# EasyEDA Pro project PCB.epro, board PCB1
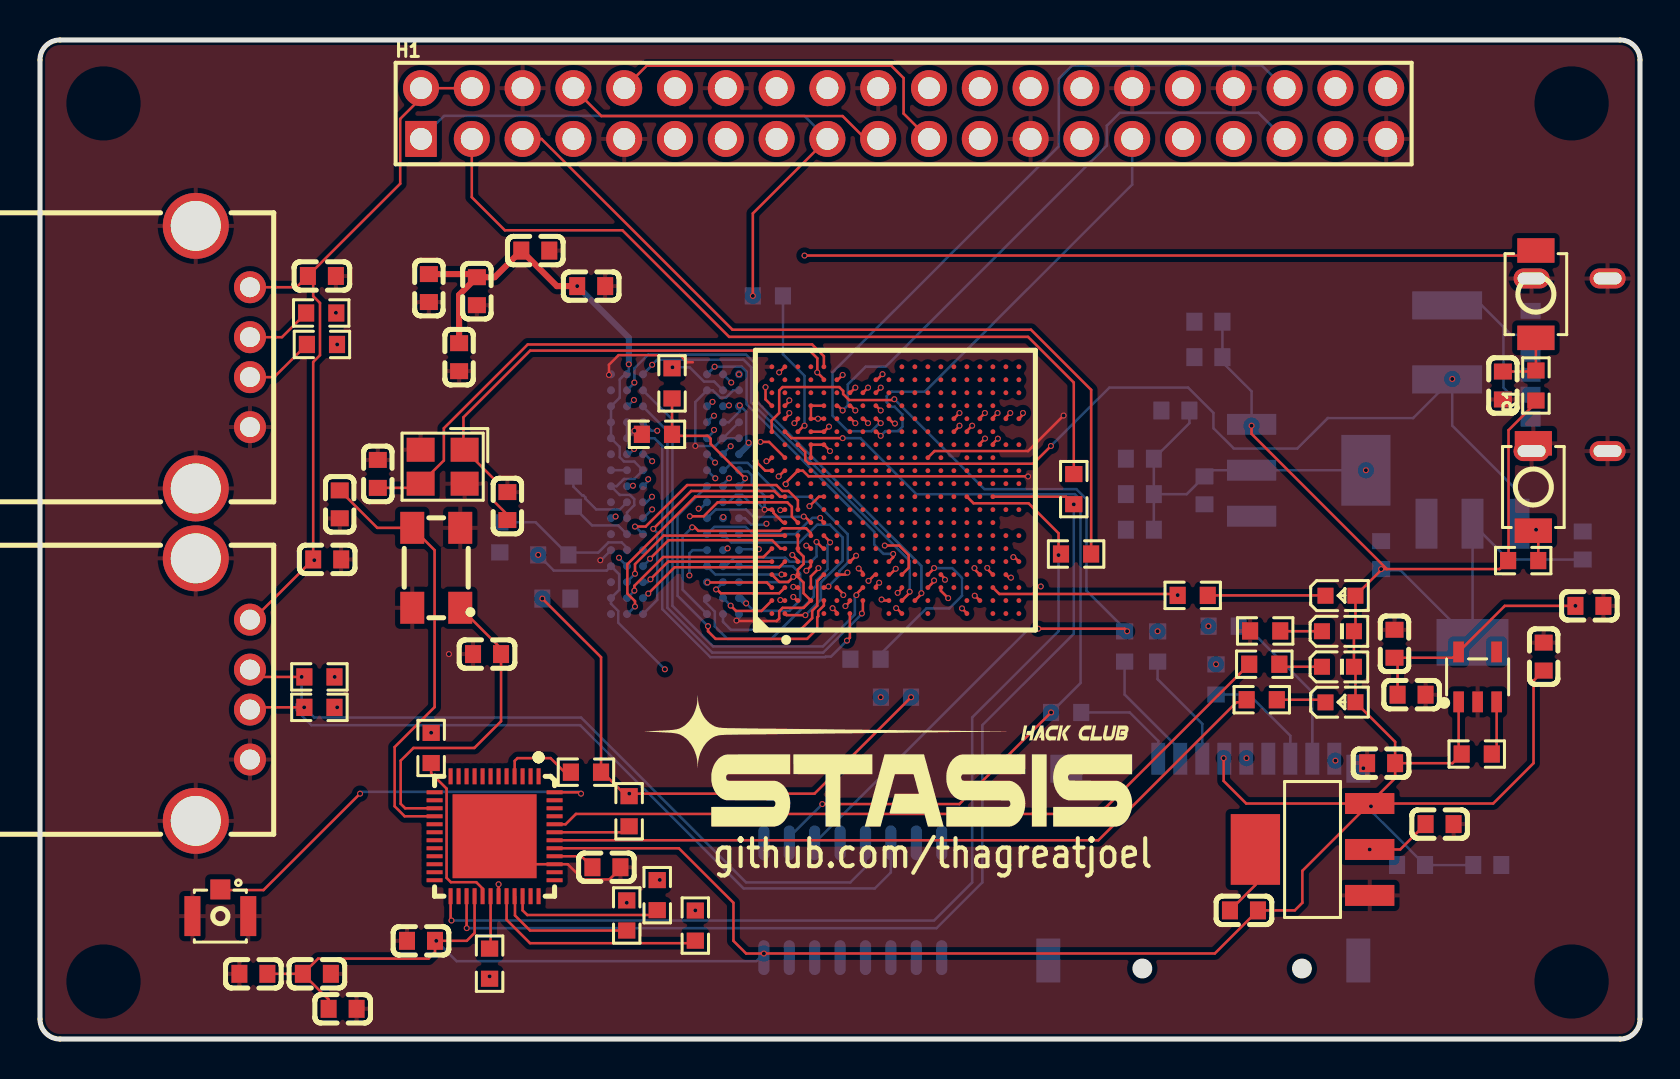
[diagram p1: board, top side]
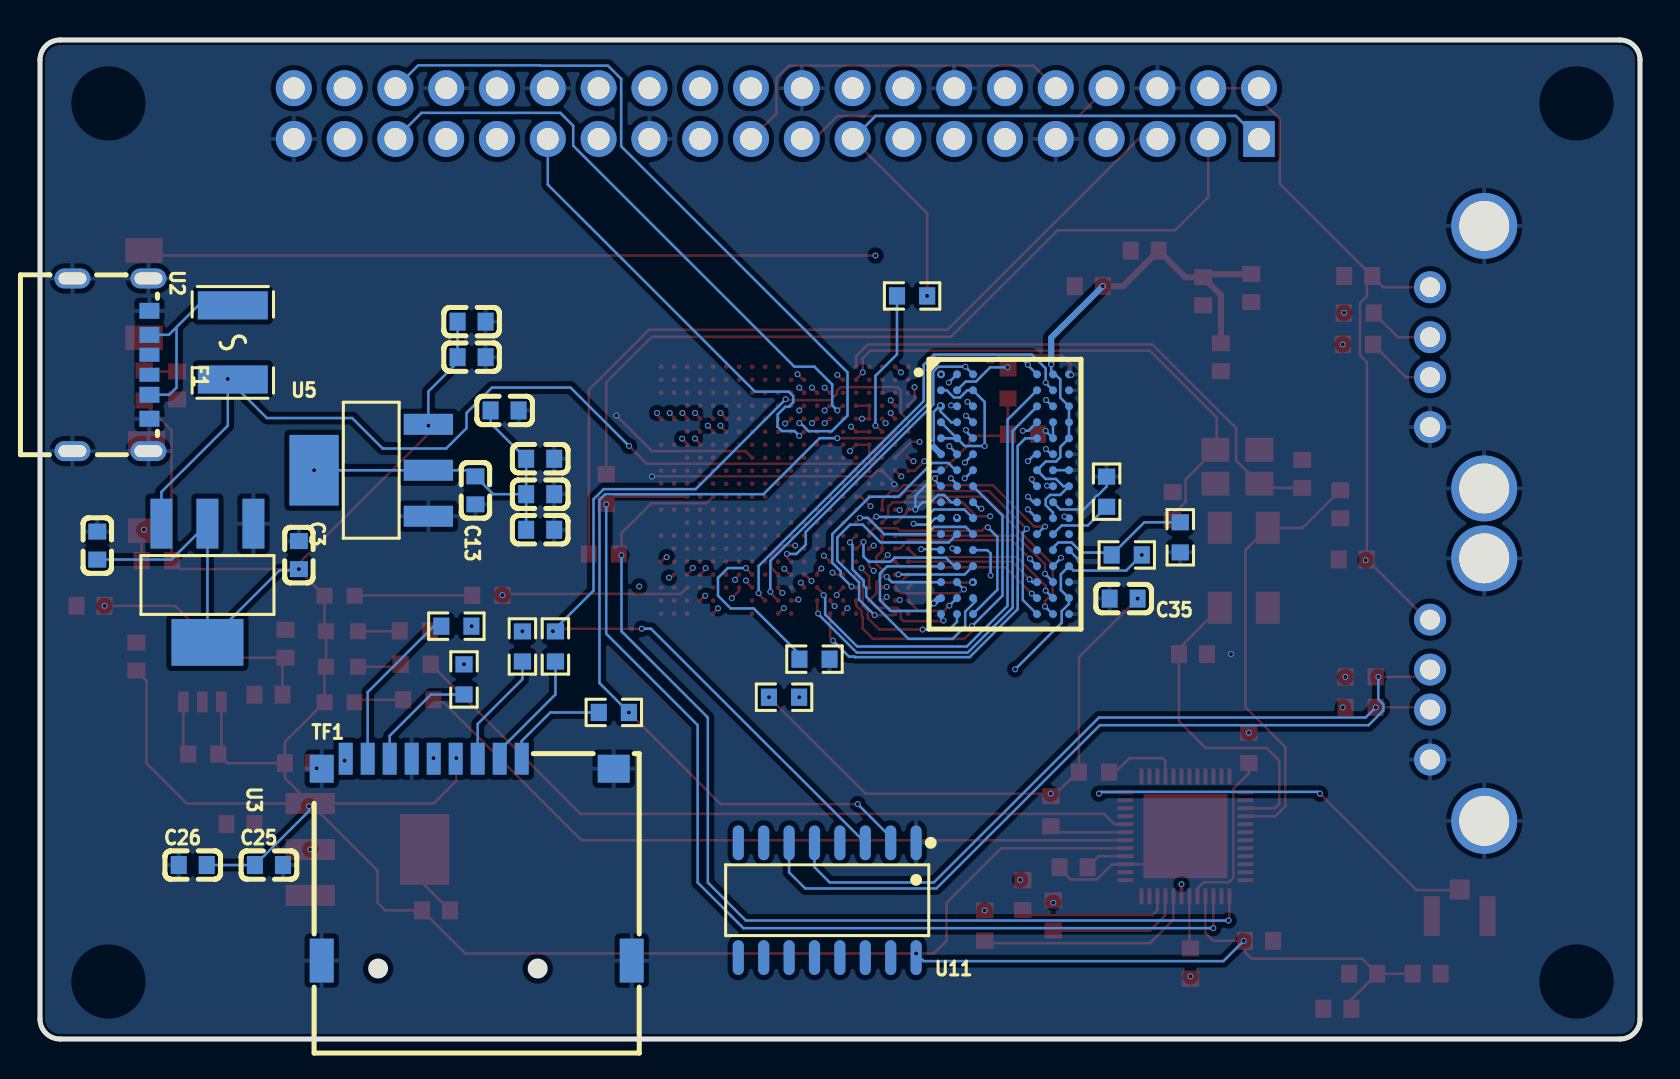
[diagram p2: board, bottom side, seen from below]

Outline 80 x 50 mm; copper layers: Top Layer, Inner1, Inner2, Inner3, Inner4, Bottom Layer. Coordinates in mm from the lower left corner of the outline.
Outline path: 0,49 0,1 arc(0.29,0.29) 1,0 79,0 arc(79.71,0.29) 80,1 80,49 arc(79.71,49.71) 79,50 1,50 arc(0.29,49.71) 0,49
Stack: Top Layer 0.035mm Outer layer thickness 1oz / Dielectric1 0.0994mm 3313 RC57% 4.2mil / Inner1 0.0152mm Inner layer thickness / Dielectric2 0.55mm 0.55mm H/H No copper / Inner2 0.0152mm Inner layer thickness / Dielectric3 0.1088mm 2116 RC54% 4.9mil / Inner3 0.0152mm Inner layer thickness / Dielectric4 0.55mm 0.55mm H/H No copper / Inner4 0.0152mm Inner layer thickness / Dielectric5 0.0994mm 3313 RC57% 4.2mil / Bottom Layer 0.035mm Outer layer thickness 1oz

## Design rules (mm)
template: Custom Config
spacing copperThickness1oz (default): track to track 0.102, other pairs 0.08 to 0.3
spacing copperThickness2oz: track to track 0.1, other pairs 0.152 to 0.3
track width copperThickness1oz (default): min 0.1, default 0.2, max 0.8
track width copperThickness2oz: min 0.203, default 0.254, max 2.54
differential pair differentialPair (default): width min 0.127, default 0.254, max 2.54; gap min 0.152, default 0.152
via viaSize (default): diameter min 0.3, default 0.3, max 0.3; hole min 0.2, default 0.2, max 0.2

## Placement (name value [footprint] x y rotation side)
C1  100nF  [C0603]  58.42 34.12 180 bottom
C2  100nF  [C0603]  54.99 29.04 180 bottom
C3  100nF  [C0603]  67.06 24.22 90 bottom
C4  100nF  [C0603]  58.42 35.9 180 bottom
C11  10uF  [C0603]  77.14 24.7 270 bottom
C12  100nF  [C0603]  54.99 27.27 180 bottom
C13  100nF  [C0603]  58.23 27.46 270 bottom
C14  100nF  [C0603]  56.77 31.46 180 bottom
C16  4.7uF  [C0603]  54.99 25.49 180 bottom
C17  1uF  [C0603]  67.72 19.78 90 top
C18  1uF  [C0603]  75.18 19.14 90 top
C21  22pF  [C0603]  16.89 28.28 270 top
C23  22pF  [C0603]  23.37 26.67 90 top
C24  100nF  [C0603]  73.14 32.71 90 top
C25  100nF  [C0603]  68.55 8.71 180 bottom
C26  10uF  [C0603]  72.36 8.71 180 bottom
C27  10uF  [C0603]  67.06 13.8 0 top
C28  10uF  [C0603]  69.98 10.76 180 top
C29  10uF  [C0603]  60.2 6.44 0 top
C30  100nF  [C0603]  27.56 37.68 0 top
C31  100nF  [C0603]  24.77 39.46 0 top
C32  100nF  [C0603]  21.84 37.43 270 top
C33  100nF  [C0603]  20.96 34.12 270 top
C34  10uF  [C0603]  19.44 37.58 270 top
C35  100nF  [C0603]  25.82 22.04 0 bottom
C36  100nF  [C0603]  19.05 4.91 180 top
C37  100nF  [C0603]  13.84 3.26 0 top
C38  100nF  [C0603]  15.13 1.51 0 top
C39  10uF  [C0603]  10.67 3.26 180 top
C40  22pF  [C0603]  14.99 26.76 90 top
C41  22pF  [C0603]  22.35 19.27 180 top
C42  100nF  [C0603]  68.58 17.23 0 top
C43  100nF  [C0603]  77.47 21.68 0 top
C44  1uF  [C0603]  28.32 8.6 180 top
C45  10uF  [C0603]  14.36 24 0 top
C46  100nF  [C0603]  14.09 38.19 180 top
F1  MINISMDC050F-2  [F1812]  70.36 34.86 90 bottom
H1  2.54mm 2*20P直排针  [HDR-TH_40P-P2.54-V-M-R2-C20-S2.54]  43.18 46.32 0 top
LED1  XL-1608UBC-04  [LED0603-RD_BLUE]  65.02 16.85 0 top
LED2  19-219/GHC-YR2T1B5Y/3T  [LED-SMD_L1.6-W0.8_19-219-GHC-YR2T1B5Y-3T]  64.9 18.63 0 top
LED3  19-219/GHC-YR2T1B5Y/3T  [LED-SMD_L1.6-W0.8_19-219-GHC-YR2T1B5Y-3T]  64.9 20.41 0 top
LED4  YLED0603W  [LED0603-RD]  65.02 22.19 0 top
R1  10kΩ  [R0603]  74.8 32.71 90 top
R2  10kΩ  [R0603]  51.31 16.34 0 bottom
R3  10kΩ  [R0603]  54.23 19.65 270 bottom
R4  10kΩ  [R0603]  55.88 19.65 270 bottom
R5  10kΩ  [R0603]  58.8 18 270 bottom
R6  10kΩ  [R0603]  59.18 20.66 0 bottom
R13  240Ω  [R0603]  26.67 27.39 270 bottom
R14  10kΩ  [R0603]  25.66 24.23 0 bottom
R15  10kΩ  [R0603]  22.99 25.11 90 bottom
R17  22Ω  [R0603]  13.97 16.6 0 top
R18  22Ω  [R0603]  14.1 34.76 0 top
R19  22Ω  [R0603]  13.97 18.12 0 top
R20  22Ω  [R0603]  14.06 36.34 0 top
R21  10kΩ  [R0603]  32.77 5.68 90 top
R22  10kΩ  [R0603]  22.48 3.77 270 top
R23  10kΩ  [R0603]  19.56 14.57 90 top
R24  10kΩ  [R0603]  29.34 6.18 90 top
R25  10kΩ  [R0603]  30.86 7.2 90 top
R26  10kΩ  [R0603]  27.3 13.35 180 top
R27  10kΩ  [R0603]  29.46 11.4 90 top
R28  330Ω  [R0603]  61.21 18.76 0 top
R29  330Ω  [R0603]  61.09 16.98 0 top
R30  10kΩ  [R0603]  42.8 17.11 180 bottom
R31  10kΩ  [R0603]  41.28 19.01 0 bottom
R32  330Ω  [R0603]  61.26 20.42 0 top
R33  10kΩ  [R0603]  36.4 37.19 180 bottom
R34  10kΩ  [R0603]  74.16 23.94 0 top
R35  330Ω  [R0603]  57.64 22.2 0 top
R36  10kΩ  [R0603]  31.6 32.81 90 top
R37  10kΩ  [R0603]  30.85 30.26 0 top
R38  10kΩ  [R0603]  71.84 14.26 180 top
R39  4.7kΩ  [R0603]  51.69 27.52 90 top
R40  4.7kΩ  [R0603]  51.8 24.27 180 top
SW2  TS-1088-AR02016  [SW-SMD_L3.9-W3.0-P4.45]  74.8 37.28 90 top
SW3  TS-1088-AR02016  [SW-SMD_L3.9-W3.0-P4.45]  74.67 27.63 90 top
TF1  TF-CARD H1.8  [TF-SMD_TF-CARD-H1.8]  58.17 8.98 180 bottom
U2  TYPEC-250Y-BRP6L68  [TYPE-C-SMD_XUNPU_TYPEC-250Y-BRP6L68]  76.45 33.74 270 bottom
U3  AMS1117-3.3  [SOT-223-3_L6.5-W3.4-P2.30-LS7.0-BR]  71.63 22.82 90 bottom
U4  RK3308B  [BGA-355_L13.0-W13.0-P0.65_RK3308]  42.77 27.47 90 top
U5  AMS1117-1.8  [SOT-223_L6.5-W3.5-P2.30-LS7.0-BR]  63.44 28.47 180 bottom
U6  ETA5050V0S2F  [SOT-23-5_L3.0-W1.5-P0.95-LS2.8-BL]  71.88 18.12 0 top
U7  K4B4G1646E-BYMA  [FBGA-96_L13.5-W7.5-R16-C6-P0.80-TL]  31.75 27.27 180 bottom
U8  SSP1117-1.5V  [SOT-223_L6.3-W3.5-P2.30-LS7.0-BR]  63.63 9.49 0 top
U11  CH340C  [SOP-16_L10.0-W3.9-P1.27-LS6.0-BL]  40.64 6.95 0 bottom
U12  RTL8723DS-CG  [WQFN-48_L6.0-W6.0-P0.40-BL-EP4.2]  22.73 10.15 180 top
U14  6GHz  [IPEX-SMD_4P-L2.6-W2.6-LS3.0-1]  9.02 6.82 180 top
USB1  USB-231-ARY  [USB-A-TH_USB-231-ARY]  9.14 17.49 270 top
USB2  USB-231-ARY  [USB-A-TH_USB-231-ARY]  9.14 34.12 270 top
X1  24MHz  [CRYSTAL-SMD_4P-L3.2-W2.5-BL]  20.13 28.64 180 top
X3  40MHz  [CRYSTAL-SMD_4P-L5.0-W3.2-BL]  19.81 23.58 90 top

## Footprints (pads in the part's own frame, mm; a bottom-side part is the same pattern mirrored in y, then rotated)
BGA-355_L13.0-W13.0-P0.65_RK3308
  round 0.24 smd: A1(-6.175,6.175) A2(-5.525,6.175) A3(-4.875,6.175) A4(-4.225,6.175) A5(-3.575,6.175) A6(-2.925,6.175) A9(-0.975,6.175) A10(-0.325,6.175) A12(0.975,6.175) A13(1.625,6.175) A15(2.925,6.175) A17(4.225,6.175) A18(4.875,6.175) A19(5.525,6.175) A20(6.175,6.175) B1(-6.175,5.525) B2(-5.525,5.525) B3(-4.875,5.525) B4(-4.225,5.525) B5(-3.575,5.525) B6(-2.925,5.525) B7(-2.275,5.525) B8(-1.625,5.525) B9(-0.975,5.525) B10(-0.325,5.525) B11(0.325,5.525) B12(0.975,5.525) B13(1.625,5.525) B14(2.275,5.525) B15(2.925,5.525) B16(3.575,5.525) B17(4.225,5.525) B18(4.875,5.525) B19(5.525,5.525) B20(6.175,5.525) C2(-5.525,4.875) C3(-4.875,4.875) C4(-4.225,4.875) C5(-3.575,4.875) C6(-2.925,4.875) C7(-2.275,4.875) C8(-1.625,4.875) C9(-0.975,4.875) C11(0.325,4.875) C12(0.975,4.875) C13(1.625,4.875) C14(2.275,4.875) C15(2.925,4.875) C16(3.575,4.875) C17(4.225,4.875) C18(4.875,4.875) C19(5.525,4.875) C20(6.175,4.875) D2(-5.525,4.225) D3(-4.875,4.225) D5(-3.575,4.225) D6(-2.925,4.225) D7(-2.275,4.225) D8(-1.625,4.225) D10(-0.325,4.225) D11(0.325,4.225) D12(0.975,4.225) D13(1.625,4.225) D14(2.275,4.225) D15(2.925,4.225) D16(3.575,4.225) D17(4.225,4.225) D18(4.875,4.225) D19(5.525,4.225) D20(6.175,4.225) E1(-6.175,3.575) E2(-5.525,3.575) E3(-4.875,3.575) E4(-4.225,3.575) E5(-3.575,3.575) E6(-2.925,3.575) E7(-2.275,3.575) E8(-1.625,3.575) E9(-0.975,3.575) E10(-0.325,3.575) E11(0.325,3.575) E12(0.975,3.575) E13(1.625,3.575) E14(2.275,3.575) E15(2.925,3.575) E16(3.575,3.575) E17(4.225,3.575) E18(4.875,3.575) E19(5.525,3.575) E20(6.175,3.575) F1(-6.175,2.925) F2(-5.525,2.925) F3(-4.875,2.925) F4(-4.225,2.925) F5(-3.575,2.925) F6(-2.925,2.925) F7(-2.275,2.925) F8(-1.625,2.925) F9(-0.975,2.925) F10(-0.325,2.925) F11(0.325,2.925) F12(0.975,2.925) F13(1.625,2.925) F14(2.275,2.925) F15(2.925,2.925) F16(3.575,2.925) F17(4.225,2.925) F18(4.875,2.925) F19(5.525,2.925) G1(-6.175,2.275) G2(-5.525,2.275) G3(-4.875,2.275) G5(-3.575,2.275) G6(-2.925,2.275) G8(-1.625,2.275) G9(-0.975,2.275) G10(-0.325,2.275) G11(0.325,2.275) G12(0.975,2.275) G13(1.625,2.275) G14(2.275,2.275) G15(2.925,2.275) G16(3.575,2.275) G17(4.225,2.275) G18(4.875,2.275) H2(-5.525,1.625) H3(-4.875,1.625) H4(-4.225,1.625) H6(-2.925,1.625) H7(-2.275,1.625) H8(-1.625,1.625) H9(-0.975,1.625) H10(-0.325,1.625) H11(0.325,1.625) H12(0.975,1.625) H13(1.625,1.625) H14(2.275,1.625) H15(2.925,1.625) H16(3.575,1.625) H17(4.225,1.625) H18(4.875,1.625) J3(-4.875,0.975) J4(-4.225,0.975) J5(-3.575,0.975) J6(-2.925,0.975) J7(-2.275,0.975) J8(-1.625,0.975) J9(-0.975,0.975) J10(-0.325,0.975) J11(0.325,0.975) J12(0.975,0.975) J13(1.625,0.975) J14(2.275,0.975) J15(2.925,0.975) J16(3.575,0.975) J17(4.225,0.975) J18(4.875,0.975) J19(5.525,0.975) K1(-6.175,0.325) K2(-5.525,0.325) K3(-4.875,0.325) K4(-4.225,0.325) K5(-3.575,0.325) K7(-2.275,0.325) K8(-1.625,0.325) K9(-0.975,0.325) K10(-0.325,0.325) K11(0.325,0.325) K12(0.975,0.325) K13(1.625,0.325) K14(2.275,0.325) K15(2.925,0.325) K16(3.575,0.325) K17(4.225,0.325) K18(4.875,0.325) K19(5.525,0.325) L1(-6.175,-0.325) L2(-5.525,-0.325) L3(-4.875,-0.325) L4(-4.225,-0.325) L5(-3.575,-0.325) L7(-2.275,-0.325) L8(-1.625,-0.325) L9(-0.975,-0.325) L10(-0.325,-0.325) L11(0.325,-0.325) L12(0.975,-0.325) L13(1.625,-0.325) L14(2.275,-0.325) L15(2.925,-0.325) L16(3.575,-0.325) L17(4.225,-0.325) L18(4.875,-0.325) L19(5.525,-0.325) L20(6.175,-0.325) M2(-5.525,-0.975) M4(-4.225,-0.975) M5(-3.575,-0.975) M6(-2.925,-0.975) M7(-2.275,-0.975) M8(-1.625,-0.975) M9(-0.975,-0.975) M10(-0.325,-0.975) M11(0.325,-0.975) M12(0.975,-0.975) M13(1.625,-0.975) M14(2.275,-0.975) M15(2.925,-0.975) M16(3.575,-0.975) M17(4.225,-0.975) M18(4.875,-0.975) M19(5.525,-0.975) M20(6.175,-0.975) N1(-6.175,-1.625) N2(-5.525,-1.625) N3(-4.875,-1.625) N4(-4.225,-1.625) N5(-3.575,-1.625) N6(-2.925,-1.625) N7(-2.275,-1.625) N8(-1.625,-1.625) N9(-0.975,-1.625) N10(-0.325,-1.625) N11(0.325,-1.625) N12(0.975,-1.625) N13(1.625,-1.625) N14(2.275,-1.625) N15(2.925,-1.625) N16(3.575,-1.625) N17(4.225,-1.625) N18(4.875,-1.625) N19(5.525,-1.625) N20(6.175,-1.625) P3(-4.875,-2.275) P4(-4.225,-2.275) P5(-3.575,-2.275) P6(-2.925,-2.275) P7(-2.275,-2.275) P8(-1.625,-2.275) P9(-0.975,-2.275) P10(-0.325,-2.275) P11(0.325,-2.275) P12(0.975,-2.275) P13(1.625,-2.275) P14(2.275,-2.275) P15(2.925,-2.275) P16(3.575,-2.275) P17(4.225,-2.275) P18(4.875,-2.275) P19(5.525,-2.275) P20(6.175,-2.275) R3(-4.875,-2.925) R4(-4.225,-2.925) R5(-3.575,-2.925) R6(-2.925,-2.925) R7(-2.275,-2.925) R8(-1.625,-2.925) R9(-0.975,-2.925) R10(-0.325,-2.925) R11(0.325,-2.925) R12(0.975,-2.925) R14(2.275,-2.925) R15(2.925,-2.925) R16(3.575,-2.925) R17(4.225,-2.925) R18(4.875,-2.925) R19(5.525,-2.925) R20(6.175,-2.925) T1(-6.175,-3.575) T2(-5.525,-3.575) T3(-4.875,-3.575) T4(-4.225,-3.575) T5(-3.575,-3.575) T6(-2.925,-3.575) T7(-2.275,-3.575) T8(-1.625,-3.575) T9(-0.975,-3.575) T10(-0.325,-3.575) T11(0.325,-3.575) T12(0.975,-3.575) T13(1.625,-3.575) T14(2.275,-3.575) T15(2.925,-3.575) T16(3.575,-3.575) T17(4.225,-3.575) T18(4.875,-3.575) T19(5.525,-3.575) T20(6.175,-3.575) U2(-5.525,-4.225) U3(-4.875,-4.225) U4(-4.225,-4.225) U5(-3.575,-4.225) U6(-2.925,-4.225) U7(-2.275,-4.225) U8(-1.625,-4.225) U9(-0.975,-4.225) U10(-0.325,-4.225) U11(0.325,-4.225) U12(0.975,-4.225) U13(1.625,-4.225) U14(2.275,-4.225) U15(2.925,-4.225) U16(3.575,-4.225) U17(4.225,-4.225) U18(4.875,-4.225) U19(5.525,-4.225) U20(6.175,-4.225) V1(-6.175,-4.875) V2(-5.525,-4.875) V3(-4.875,-4.875) V4(-4.225,-4.875) V5(-3.575,-4.875) V6(-2.925,-4.875) V7(-2.275,-4.875) V8(-1.625,-4.875) V9(-0.975,-4.875) V10(-0.325,-4.875) V11(0.325,-4.875) V12(0.975,-4.875) V13(1.625,-4.875) V14(2.275,-4.875) V15(2.925,-4.875) V16(3.575,-4.875) V17(4.225,-4.875) V18(4.875,-4.875) V19(5.525,-4.875) V20(6.175,-4.875) W1(-6.175,-5.525) W2(-5.525,-5.525) W3(-4.875,-5.525) W4(-4.225,-5.525) W5(-3.575,-5.525) W6(-2.925,-5.525) W7(-2.275,-5.525) W9(-0.975,-5.525) W11(0.325,-5.525) W12(0.975,-5.525) W14(2.275,-5.525) W16(3.575,-5.525) W18(4.875,-5.525) W19(5.525,-5.525) W20(6.175,-5.525) Y1(-6.175,-6.175) Y2(-5.525,-6.175) Y3(-4.875,-6.175) Y5(-3.575,-6.175) Y7(-2.275,-6.175) Y9(-0.975,-6.175) Y11(0.325,-6.175) Y12(0.975,-6.175) Y14(2.275,-6.175) Y16(3.575,-6.175) Y18(4.875,-6.175) Y19(5.525,-6.175) Y20(6.175,-6.175)
C0603
  rect 0.8x0.9 smd: 1(-0.7,0) 2(0.7,0)
CRYSTAL-SMD_4P-L3.2-W2.5-BL
  rect 1.4x1.2 smd: 1(-1.1,-0.85) 2(1.1,-0.85) 3(1.1,0.85) 4(-1.1,0.85)
CRYSTAL-SMD_4P-L5.0-W3.2-BL
  rect 1.6x1.2 smd: 1(-2,-1.2) 2(2,-1.2) 3(2,1.2) 4(-2,1.2)
F1812
  rect 1.407x3.499 smd: 1(-1.853,0) 2(1.853,0)
FBGA-96_L13.5-W7.5-R16-C6-P0.80-TL
  round 0.4 smd: A1(-3.2,6) A2(-2.4,6) A3(-1.6,6) A7(1.6,6) A8(2.4,6) A9(3.2,6) B1(-3.2,5.2) B2(-2.4,5.2) B3(-1.6,5.2) B7(1.6,5.2) B8(2.4,5.2) B9(3.2,5.2) C1(-3.2,4.4) C2(-2.4,4.4) C3(-1.6,4.4) C7(1.6,4.4) C8(2.4,4.4) C9(3.2,4.4) D1(-3.2,3.6) D2(-2.4,3.6) D3(-1.6,3.6) D7(1.6,3.6) D8(2.4,3.6) D9(3.2,3.6) E1(-3.2,2.8) E2(-2.4,2.8) E3(-1.6,2.8) E7(1.6,2.8) E8(2.4,2.8) E9(3.2,2.8) F1(-3.2,2) F2(-2.4,2) F3(-1.6,2) F7(1.6,2) F8(2.4,2) F9(3.2,2) G1(-3.2,1.2) G2(-2.4,1.2) G3(-1.6,1.2) G7(1.6,1.2) G8(2.4,1.2) G9(3.2,1.2) H1(-3.2,0.4) H2(-2.4,0.4) H3(-1.6,0.4) H7(1.6,0.4) H8(2.4,0.4) H9(3.2,0.4) J1(-3.2,-0.4) J2(-2.4,-0.4) J3(-1.6,-0.4) J7(1.6,-0.4) J8(2.4,-0.4) J9(3.2,-0.4) K1(-3.2,-1.2) K2(-2.4,-1.2) K3(-1.6,-1.2) K7(1.6,-1.2) K8(2.4,-1.2) K9(3.2,-1.2) L1(-3.2,-2) L2(-2.4,-2) L3(-1.6,-2) L7(1.6,-2) L8(2.4,-2) L9(3.2,-2) M1(-3.2,-2.8) M2(-2.4,-2.8) M3(-1.6,-2.8) M7(1.6,-2.8) M8(2.4,-2.8) M9(3.2,-2.8) N1(-3.2,-3.6) N2(-2.4,-3.6) N3(-1.6,-3.6) N7(1.6,-3.6) N8(2.4,-3.6) N9(3.2,-3.6) P1(-3.2,-4.4) P2(-2.4,-4.4) P3(-1.6,-4.4) P7(1.6,-4.4) P8(2.4,-4.4) P9(3.2,-4.4) R1(-3.2,-5.2) R2(-2.4,-5.2) R3(-1.6,-5.2) R7(1.6,-5.2) R8(2.4,-5.2) R9(3.2,-5.2) T1(-3.2,-6) T2(-2.4,-6) T3(-1.6,-6) T7(1.6,-6) T8(2.4,-6) T9(3.2,-6)
HDR-TH_40P-P2.54-V-M-R2-C20-S2.54
  rect 1.575x1.8 hole 1.1: 1(-24.13,-1.27)
  round 1.8 hole 1.1: 2(-24.13,1.27) 3(-21.59,-1.27) 4(-21.59,1.27) 5(-19.05,-1.27) 6(-19.05,1.27) 7(-16.51,-1.27) 8(-16.51,1.27) 9(-13.97,-1.27) 10(-13.97,1.27) 11(-11.43,-1.27) 12(-11.43,1.27) 13(-8.89,-1.27) 14(-8.89,1.27) 15(-6.35,-1.27) 16(-6.35,1.27) 17(-3.81,-1.27) 18(-3.81,1.27) 19(-1.27,-1.27) 20(-1.27,1.27) 21(1.27,-1.27) 22(1.27,1.27) 23(3.81,-1.27) 24(3.81,1.27) 25(6.35,-1.27) 26(6.35,1.27) 27(8.89,-1.27) 28(8.89,1.27) 29(11.43,-1.27) 30(11.43,1.27) 31(13.97,-1.27) 32(13.97,1.27) 33(16.51,-1.27) 34(16.51,1.27) 35(19.05,-1.27) 36(19.05,1.27) 37(21.59,-1.27) 38(21.59,1.27) 39(24.13,-1.27) 40(24.13,1.27)
IPEX-SMD_4P-L2.6-W2.6-LS3.0-1
  rect 1x1 smd: 1(0,-0.667)
  rect 0.8x2 smd: 2(-1.397,0.667) 2(1.397,0.667)
LED0603-RD
  rect 0.8x0.8 smd: 1(-0.749,0) 2(0.749,0)
LED0603-RD_BLUE
  rect 0.8x0.8 smd: 1(-0.749,-0.004) 2(0.749,0.004)
LED-SMD_L1.6-W0.8_19-219-GHC-YR2T1B5Y-3T
  rect 0.8x0.8 smd: 1(0.799,0) 2(-0.799,0)
R0603
  rect 0.806x0.864 smd: 1(-0.753,0) 2(0.753,0)
SOP-16_L10.0-W3.9-P1.27-LS6.0-BL
  oval 0.56x1.745 smd: 1(-4.445,-2.873) 2(-3.175,-2.873) 3(-1.905,-2.873) 4(-0.635,-2.873) 5(0.635,-2.873) 6(1.905,-2.873) 7(3.175,-2.873) 8(4.445,-2.873) 9(4.445,2.873) 10(3.175,2.873) 11(1.905,2.873) 12(0.635,2.873) 13(-0.635,2.873) 14(-1.905,2.873) 15(-3.175,2.873) 16(-4.445,2.873)
SOT-23-5_L3.0-W1.5-P0.95-LS2.8-BL
  rect 0.532x1.045 smd: 1(-0.95,-1.25) 2(0,-1.25) 3(0.95,-1.25) 4(0.95,1.25) 5(-0.95,1.25)
SOT-223-3_L6.5-W3.4-P2.30-LS7.0-BR
  rect 2.5x1.1 smd: 1(2.97,-2.3) 2(2.97,0) 3(2.97,2.3)
  rect 2.34x3.6 smd: 4(-2.97,0)
SOT-223_L6.3-W3.5-P2.30-LS7.0-BR
  rect 2.465x1.05 smd: 1(2.857,-2.3) 2(2.857,0) 3(2.857,2.3)
  rect 2.465x3.54 smd: 4(-2.857,0)
SOT-223_L6.5-W3.5-P2.30-LS7.0-BR
  rect 2.465x1.05 smd: 1(2.857,-2.3) 2(2.857,0) 3(2.857,2.3)
  rect 2.465x3.54 smd: 4(-2.857,0)
SW-SMD_L3.9-W3.0-P4.45
  rect 1.23x1.86 smd: 1(-2.185,0) 2(2.185,0)
TF-SMD_TF-CARD-H1.8
  rect 0.7x1.6 smd: 1(2.25,5.05) 2(1.15,5.05) 3(0.05,5.05) 4(-1.05,5.05) 5(-2.15,5.05) 6(-3.25,5.05) 7(-4.35,5.05) 8(-5.45,5.05) 9(-6.55,5.05)
  rect 1.2x1.4 smd: 10(-7.747,4.55)
  rect 1.2x2.2 smd: 11(-7.75,-5.05) 12(7.75,-5.05)
  rect 1.6x1.4 smd: 13(6.85,4.55)
TYPE-C-SMD_XUNPU_TYPEC-250Y-BRP6L68
  oval 1x1.8 hole 0.6x1.4: 7(-4.32,-1.925) 7(-4.32,1.875) 7(4.32,-1.925) 7(4.32,1.875)
  rect 0.7x1 smd: A5(-0.5,1.925) B5(0.5,1.925)
  rect 0.8x1 smd: A9(1.5,1.925) A12(2.7,1.925) B9(-1.5,1.925) B12(-2.7,1.925)
USB-A-TH_USB-231-ARY
  round 1.6 hole 1: 1(-3.5,1.355) 2(-1,1.355) 3(1,1.355) 4(3.5,1.355)
  round 3.3 hole 2.5: 5(-6.57,-1.355) 6(6.57,-1.355)
WQFN-48_L6.0-W6.0-P0.40-BL-EP4.2
  rect 0.2x0.8 smd: 1(-2.2,-3) 2(-1.8,-3) 3(-1.4,-3) 4(-1,-3) 5(-0.6,-3) 6(-0.2,-3) 7(0.2,-3) 8(0.6,-3) 9(1,-3) 10(1.4,-3) 11(1.8,-3) 12(2.2,-3) 25(2.2,3) 26(1.8,3) 27(1.4,3) 28(1,3) 29(0.6,3) 30(0.2,3) 31(-0.2,3) 32(-0.6,3) 33(-1,3) 34(-1.4,3) 35(-1.8,3) 36(-2.2,3)
  rect 0.8x0.2 smd: 13(3,-2.2) 14(3,-1.8) 15(3,-1.4) 16(3,-1) 17(3,-0.6) 18(3,-0.2) 19(3,0.2) 20(3,0.6) 21(3,1) 22(3,1.4) 23(3,1.8) 24(3,2.2) 37(-3,2.2) 38(-3,1.8) 39(-3,1.4) 40(-3,1) 41(-3,0.6) 42(-3,0.2) 43(-3,-0.2) 44(-3,-0.6) 45(-3,-1) 46(-3,-1.4) 47(-3,-1.8) 48(-3,-2.2)
  rect 4.2x4.2 smd: 49(0,0)

## Nets
As in the schematic.

Pads without a net: U2 A5 B5; U4 A1 A18 A19 B14 B18 B19 C11 C13 C17 C18 C19 C20 D10 D11 D12 D18 D19 D20 E1 E5 E9 E11 E12 E13 E18 F2 F5 F6 F7 F8 F9 F10 F11 F12 F13 F14 F15 F16 F18 G3 G6 G8 G9 G10 G11 G12 G13 G14 G15 H6 H7 H8 H9 H10 H11 H12 H13 H14 H15 H17 J5 J6 J7 J8 J9 J10 J11 J12 J13 J14 K1 K3 K7 K8 K9 K10 K11 K12 K13 K14 K15 K17 K18 K19 L5 L7 L8 L9 L10 L11 L12 L13 L14 L15 L16 L17 L18 L19 L20 M4 M5 M6 M7 M8 M9 M10 M11 M12 M13 M14 M15 M16 M17 M18 M19 M20 N1 N2 N5 N6 N7 N8 N9 N10 N11 N12 N14 N15 N16 N17 N18 N19 N20 P5 P6 P7 P8 P9 P10 P11 P12 P13 P14 P15 P16 P17 P18 P19 P20 R3 R4 R5 R6 R7 R8 R9 R10 R11 R12 R14 R17 R18 R19 R20 T2 T3 T4 T5 T6 T7 T8 T9 T11 T12 T13 T14 T16 T17 T18 T19 T20 U3 U5 U6 U7 U8 U9 U10 U11 U12 U13 U15 U17 U18 U19 U20 V1 V2 V5 V6 V7 V8 V9 V11 V12 V13 V15 V17 V18 V19 V20 W1 W2 W3 W5 W6 W7 W9 W11 W12 W14 W18 W19 W20 Y1 Y2 Y3 Y7 Y9 Y11 Y12 Y14 Y18 Y19 Y20; U6 4; U7 J1 J9 L1 L9 M7; U11 4 7 8 9 10 11 12 13 14 15; U12 1 2 3 5 6 7 8 9 10 11 12 13 14 17 18 19 20 21 22 23 24 26 35 36 37 38 45 46 47

## Via types
v1: diameter 0.3, hole 0.2, Top Layer to Bottom Layer, 196 vias

## Routing (per net, layer and track width the routed paths; a pad name or vN(x,y) marks a point on that pad's centre or on a via; arc(x,y) is an arc through that point)
1V0: length 56.1
  Top Layer w0.127: U4.D15 U4.E15 ; 39.19,30.39 v1(39.45,30.65) ; C42.1 67.88,18.93 C17.1 70.64,19.08 U6.5 73.24,21.68 v1(76.77,21.68)
  Inner4 w0.127: v1(76.77,21.68) 76.77,24.66 75.18,26.25 43.33,26.25 39.69,29.89 39.69,30.41 v1(39.45,30.65)
1V5: length 142.5
  Top Layer w0.127: U4.E10 38.95,27.14 v1(38.47,26.67) ; C28.2 68.01,9.49 v1(66.48,9.49)
  Top Layer w0.305: C34.1 21.69,38.28 C32.1 ; C32.1 20.96,37.24 C33.1 ; C32.1 22.73,38.13 C31.1 25.84,37.68 v1(26.86,37.68)
  Inner1 w0.127: v1(34.95,33.27) 31.97,33.27 v1(31.62,33.62) 31.41,33.4 29.8,33.4 v1(29.44,33.77) 27.46,33.77 24.91,31.22 v1(24.91,24.23) ; v1(31.24,18.5) 40.26,9.49 v1(66.48,9.49)
  Inner2 w0.127: v1(34.45,28.06) 34.94,28.55 36.43,28.55 36.66,28.78 36.66,29.06 36.35,29.37 35.91,29.37 v1(35.44,29.84)
  Inner3 w0.127: v1(35.44,29.84) 35.59,29.84 35.94,29.49 36.26,29.49 38.47,27.27 v1(38.47,26.67)
  Inner4 w0.127: v1(34.99,31.71) 34.99,33.23 v1(34.95,33.27)
  Inner4 w0.305: v1(35.31,21.81) 35.31,24.98 v1(34.16,26.12) 34.16,25.49 33.53,24.85 25.54,24.85 v1(24.91,24.23)
  Bottom Layer w0.127: U7.K8 29.35,26.35 29.71,26.72 29.71,27.02 29.5,27.23 28.99,27.23 U7.H9 28.84,27.67 29.2,28.03 29.71,28.03 U7.G7 29.71,28.9 29.2,28.9 28.99,29.12 28.99,29.63 U7.E9 U7.D9 U7.C9 28.99,32.1 28.99,33.01 29.44,33.47 v1(29.44,33.77) ; v1(31.24,18.5) 28.91,20.83 28.91,21.42 28.55,21.78 U7.R9 28.96,22.47 28.96,23.26 U7.N9 28.33,23.45 25.69,23.45 v1(24.91,24.23) ; U7.H2 34.15,27.76 v1(34.45,28.06) ; U7.D2 34.44,30.87 34.99,31.42 v1(34.99,31.71) 35.31,31.39 35.31,29.96 v1(35.44,29.84) ; U7.N1 34.96,23.66 37.65,23.66 37.98,23.32 37.98,23.3 38,23.27 38,21.98 37.98,21.96 37.98,21.94 37.47,21.42 35.69,21.42 v1(35.31,21.81) ; v1(31.62,33.62) 32.49,33.62 33.2,32.9 33.71,32.9 U7.B2
  Bottom Layer w0.305: v1(29.44,33.77) 29.44,35.1 v1(26.86,37.68) ; v1(35.44,29.84) 35.44,29.75 U7.F1 ; v1(35.31,21.81) 35.05,22.07 U7.R1
1V8: length 49.2
  Top Layer w0.127: U4.E16 v1(38.9,31.04) U4.D16 U4.D17 U4.E17
  Inner4 w0.127: v1(66.3,28.47) 65.1,27.27 43.52,27.27 39.71,31.08 39.27,31.08 39.24,31.04 v1(38.9,31.04)
  Bottom Layer w0.127: C12.1 57.34,27.27 C13.1 58.53,28.47 U5.2 v1(66.3,28.47) ; C12.1 C16.1 ; C12.1 C2.1 57.47,30.82 C14.1
+5V: length 9.3
  Bottom Layer w0.127: 73.17,35.63 73.56,35.24 U2.B9 ; 73.17,35.63 72.08,36.72 F1.2 ; 73.17,35.63 73.17,32.6 73.53,32.24 U2.A9
GND: length 72.8
  Top Layer w0.127: 44.39,29.09 44.73,29.43 49.4,29.43 v1(51.18,31.2) ; U4.C7 U4.C6 37.89,24.43 38.18,24.14 38.18,23.78 37.89,23.49 U4.C4 ; v1(49.4,28.16) 49.4,28.16 38.43,28.16 38.14,28.44 U4.C12 37.24,27.79 ; v1(29.72,30.44) 29.92,30.44 R37.1 ; U4.A4 36.96,22.88 37.41,22.88 v1(37.66,23.13) 37.78,23.13 U4.C4 ; v1(28.45,33.24) 28.45,33.74 28.93,34.23 32.01,34.23 32.36,33.87 32.64,33.87 ; U4.C4 37.89,23.13 38.18,22.84 38.18,22.31 U4.D2 38.18,21.58 37.13,21.58 36.96,21.41 36.96,21.05 36.83,20.92 34.85,20.92 v1(34.82,20.94) ; C44.1 29.02,8.54 28.47,7.98 27.15,7.98 26.39,8.75 U12.39 24.13,8.75 U12.49 ; U4.B8 37.16,25.84 36.68,26.33 36.68,26.41 36.59,26.49 v1(36.23,26.49)
  Inner3 w0.127: v1(36.23,26.49) 37.29,27.55 v1(37.29,27.77)
  Inner4 w0.127: v1(35.94,24.51) 35.98,24.47 36.32,24.47 37.21,23.59 37.22,23.59 37.42,23.39 37.42,23.38 v1(37.66,23.13)
  Bottom Layer w0.127: U7.E2 33.76,29.68 v1(32.77,29.68) 32.77,31.88 U7.B3 33.64,32.47 34,32.1 34.3,32.1 34.66,32.47 U7.B1 ; U7.E2 U7.E1 ; U7.E2 U7.D1 ; v1(37.66,23.13) 37.4,22.87 U7.P1 ; U7.D8 U7.E8 29.72,30.44 v1(29.72,30.44) ; U7.M1 35,24.51 v1(35.94,24.51) ; v1(34.82,20.94) 34.95,21.07 U7.T1 ; U7.J2 34.44,26.87 34.8,27.23 35.1,27.23 35.46,26.87 35.86,26.87 v1(36.23,26.49) 36.23,27.18 35.59,27.82 35.59,28.2 35.39,28.4 35.01,28.4 U7.G1 ; v1(28.01,23.96) 28.05,23.96 U7.M9 ; U7.J8 28.99,26.5 27.81,26.5 27.27,27.05 27.27,27.11 27.17,27.21 27.11,27.21 26.67,27.65 R13.1 ; U7.G8 U7.G9
  vias: v1(20.45,19.27) v1(66.17,13.55)
V3: length 47.4
  Top Layer w0.127: v1(56.88,22.22) 56.82,22.27 47.96,22.27 U4.V3
  Inner3 w0.127: v1(56.88,22.22) 49.8,29.3 41.66,29.3 31.75,39.2 H1.11
V4: length 30.4
  Top Layer w0.127: U4.V4 47.36,23.52 v1(47.36,23.58)
  Inner1 w0.127: v1(47.36,23.58) 47.36,27.08 44.4,30.04 44.4,36.97 37.45,43.92 36.36,43.92 35.7,44.58 35.7,46.46 H1.16
V16: length 32.9
  Top Layer w0.127: H1.19 41.28,45.05 40.13,46.19 28.07,46.19 H1.8 ; U4.V16 47.64,31.1 v1(47.88,31.33)
  Inner1 w0.127: H1.19 47.88,39.08 v1(47.88,31.33)
VBUS: length 178.9
  Top Layer w0.127: USB1.1 10.64,20.99 C45.1 13.66,33.88 14,34.22 14,36.84 13.66,37.18 13.66,37.92 C46.2 ; USB2.1 12.83,37.62 C46.2 ; C46.2 18.01,42.81 18.01,46.05 19.05,47.09 H1.2 H1.4 ; U4.C14 38.26,29.38 38.26,28.98 38.43,28.81 38.43,28.81 38.45,28.79 49.66,28.79 v1(50.55,29.68)
  Inner4 w0.127: v1(13.72,23.96) 14.31,23.37 14.31,18.31 14.3,18.3 14.3,17.95 14.31,17.94 14.31,13.03 14.53,12.81 74.96,12.81 77.22,15.07 77.22,20.92 77.2,20.93 77.2,24.81 70.61,31.4 v1(70.61,33.03)
  Bottom Layer w0.127: v1(50.55,29.68) 53.47,32.6 57.41,32.6 58.67,31.33 58.67,30.57 59.69,29.55 62.87,29.55 64.39,31.08 68.66,31.08 v1(70.61,33.03) 70.61,30.7 73.93,27.38 U3.3
VCC: length 326.3
  Top Layer w0.127: C38.1 14.43,1.97 C37.1 ; U8.3 72.66,11.79 74.68,13.8 74.68,17.93 C18.1 ; U8.3 60.31,11.79 59.18,12.92 v1(59.18,14.06) ; U8.3 67.76,13.06 C27.2 ; U8.3 63.12,8.42 63.12,6.82 62.74,6.44 C29.2 58.74,4.28 36.2,4.28 ; v1(25.12,22.04) 28.05,19.11 R26.1 28.13,13.35 29.46,12.03 ; H1.17 35.64,41.32 v1(35.64,37.19) ; 67.35,23.52 v1(67.06,23.52) 67.06,23.47 LED4.2 65.77,20.49 LED3.1 LED2.1 65.77,18.55 LED1.2 67.76,14.87 C27.2 ; 67.35,23.52 60.58,30.29 v1(60.58,30.7) ; 67.35,23.52 72.98,23.52 R34.1 73.43,23.96 73.43,30.47 74.8,31.84 R1.1 ; v1(29.46,12.28) 38.73,12.28 v1(43.55,17.11) ; U12.28 21.73,5.31 21.34,4.91 C36.1 19.75,4.34 19.43,4.03 13.91,4.03 C37.1 ; C27.2 70.63,13.8 R38.2 70.93,14.41 U6.1 ; v1(36.19,4.28) 35.31,4.28 34.67,4.91 34.67,6.82 31.94,9.55 U12.41 ; C39.1 C37.1 ; 38.54,29.09 U4.D14 U4.E14 39.5,29.44 v1(39.5,29.42)
  Inner2 w0.127: v1(39.5,29.42) 40.38,29.42 40.64,29.68 40.64,30.34 39.7,31.28 39.7,33.13 v1(35.64,37.19)
  Inner3 w0.127: v1(29.46,12.28) 62.43,12.28 62.74,12.59 62.74,19.2 v1(67.06,23.52)
  Inner4 w0.127: v1(39.5,29.42) 44.71,24.21 47.96,24.21 48.66,23.52 v1(67.06,23.52)
  Bottom Layer w0.127: v1(66.55,11.65) 66.55,11.41 C25.1 C26.2 ; 67.06,23.46 68.02,23.46 U3.4 U3.2 73.42,24 77.26,24 ; U5.3 60.58,32.41 59.12,33.87 ; U11.16 v1(36.19,4.28) 35.81,3.9 20.83,3.9 v1(19.81,4.91) ; H1.17 38.22,46.2 20.2,46.2 H1.1 ; C1.1 C4.1
A0: length 4.1
  Top Layer w0.127: v1(37.08,23.25) 37.24,23.25 U4.B4
  Bottom Layer w0.127: v1(37.08,23.25) 33.77,23.25 U7.N3
A1: length 6.9
  Top Layer w0.127: U4.A5 31.41,23.89 v1(30.52,23.01)
  Bottom Layer w0.127: U7.P7 30.38,22.87 v1(30.52,23.01)
A2: length 3.4
  Top Layer w0.127: U4.A3 36.34,22.85 v1(33.37,22.85)
  Bottom Layer w0.127: v1(33.37,22.85) 33.37,22.85 U7.P3
A3: length 6.3
  Top Layer w0.127: v1(38.83,24.88) 39.16,24.54 U4.E6
  Bottom Layer w0.127: U7.N2 34.28,23.67 34.7,24.09 37.27,24.09 37.48,23.89 38.56,23.89 38.83,24.15 v1(38.83,24.88)
A4: length 9.2
  Top Layer w0.127: U4.B7 31.18,25.19 29.75,23.77 v1(29.75,23.29)
  Bottom Layer w0.127: U7.P8 29.35,22.89 v1(29.75,23.29)
A5: length 4.1
  Top Layer w0.127: U4.B3 36.96,22.31 34.04,22.31 33.85,22.5 v1(33.8,22.5)
  Bottom Layer w0.127: U7.P2 34.15,22.85 v1(33.8,22.5)
A6: length 8.4
  Top Layer w0.127: U4.A6 36.17,24.12 31.16,24.12 29.72,22.68 v1(29.72,22.44)
  Bottom Layer w0.127: v1(29.72,22.44) 29.72,22.44 U7.R8
A7: length 2.9
  Top Layer w0.127: U4.A2 36.08,21.42 34.8,21.42 v1(34.53,21.69)
  Bottom Layer w0.127: v1(34.53,21.69) 34.16,22.07 U7.R2
A8: length 11.5
  Top Layer w0.127: v1(29.75,21.65) 29.75,21.91 29.37,22.3 29.37,23.76 32.75,27.14 U4.A10
  Bottom Layer w0.127: v1(29.75,21.65) 29.37,21.27 U7.T8
A9: length 11.3
  Top Layer w0.127: v1(39.5,24.85) 39.5,24.88 U4.E7
  Bottom Layer w0.127: v1(39.5,24.85) 39.38,24.73 39.38,23.51 38.82,22.95 38.82,22.69 38.69,22.57 38.69,22.14 36.57,20.03 34.37,20.03 33.74,20.65 33.74,21.39 33.22,21.91 33.22,21.94 U7.R3
A10: length 10.3
  Top Layer w0.127: 37.89,26.49 37.89,26.96 37.43,27.43 37.11,27.43 36.82,27.72 32.36,27.72 30.28,25.65 v1(29.75,25.65)
  Bottom Layer w0.127: v1(29.75,25.65) 29.77,25.65 U7.L7
A11: length 7.9
  Top Layer w0.127: v1(30.41,22.29) 31.73,23.61 36.96,23.61 U4.B5
  Bottom Layer w0.127: v1(30.41,22.29) 30.38,22.29 U7.R7
A12: length 7.8
  Top Layer w0.127: U4.B6 37.03,24.54 36.61,24.96 31.43,24.96 v1(30.5,24.04)
  Bottom Layer w0.127: U7.N7 30.5,24.02 v1(30.5,24.04)
A13: length 11.3
  Top Layer w0.127: U4.D7 38.54,25.32 38.3,25.56 37.13,25.56 37,25.43 32.91,25.43 32.74,25.61 v1(32.61,25.61)
  Bottom Layer w0.127: U7.T3 32.13,22.49 32.13,25.13 v1(32.61,25.61)
A14: length 12.1
  Top Layer w0.127: U4.B10 37,27.14 36.71,27.43 32.56,27.43 v1(30.66,25.53)
  Bottom Layer w0.127: U7.T7 30.86,21.98 30.86,25.34 v1(30.66,25.53)
BA0: length 4.2
  Top Layer w0.127: U4.B2 37.04,21.94 v1(37.02,21.97)
  Inner2 w0.127: v1(37.02,21.97) 36.97,21.97 v1(34.38,24.56)
  Bottom Layer w0.127: v1(34.38,24.56) 34.29,24.47 U7.M2
BA1: length 11.4
  Top Layer w0.127: U4.C8 37.59,26.15 37.59,26.63 37.36,26.86 33.88,26.86 33.18,26.16 v1(32.49,26.16)
  Inner2 w0.127: v1(28.95,24.09) 30.05,24.09 30.36,24.39 30.72,24.39 v1(32.49,26.16)
  Bottom Layer w0.127: v1(28.95,24.09) 28.95,24.07 U7.N8
BA2: length 10
  Top Layer w0.127: v1(38.32,24.69) 38.4,24.69 U4.D6
  Inner2 w0.127: v1(38.32,24.69) 37.77,25.23 33.15,25.23 32.47,24.56 v1(32.47,23.2)
  Bottom Layer w0.127: U7.M3 32.63,24.47 32.47,24.3 v1(32.47,23.2)
CAS#: length 5.7
  Top Layer w0.127: v1(38.19,26.15) 38.24,26.15 U4.D8
  Bottom Layer w0.127: v1(38.19,26.15) 38.17,26.13 35.68,26.13 35.31,26.5 33.79,26.5 U7.K3
CKE: length 9.3
  Top Layer w0.127: v1(37.02,26.47) 37.22,26.47 37.24,26.49
  Inner1 w0.127: v1(28.78,26.15) 30.46,26.15 30.46,26.15 30.75,26.15 31.48,26.88 36.69,26.88 37.02,26.56 v1(37.02,26.47)
  Bottom Layer w0.127: v1(28.78,26.15) 28.63,26.15 U7.K9
CS#: length 12.5
  Top Layer w0.127: v1(38.27,21.21) 37.32,21.21 U4.B1
  Bottom Layer w0.127: v1(38.27,21.21) 39.05,21.99 39.05,22.85 40.13,23.94 40.13,25.11 39.5,25.74 38.86,25.74 37.97,24.85 34.56,24.85 U7.L2
D+: length 36.1
  Top Layer w0.127: USB1.3 10.61,16.6 13.34,16.6
  Bottom Layer w0.127: U11.5 41.28,8.6 40.51,7.84 35.31,7.84 27.05,16.09 13.72,16.09 v1(13.21,16.6)
D+1: length 3.5
  Top Layer w0.127: R18.1 11.71,33.12 USB2.3
D-: length 39.9
  Top Layer w0.127: USB1.2 10.86,18.12 R19.1
  Bottom Layer w0.127: U11.6 42.55,8.34 41.74,7.53 35.18,7.53 27.01,15.7 13.57,15.7 12.83,16.44 12.83,16.75 13.08,17 v1(13.08,18.12)
D-1: length 3.3
  Top Layer w0.127: USB2.2 12.1,35.12 R20.1
DDR-CK: length 9.8
  Top Layer w0.127: v1(37.67,22.63) 37.7,22.59 U4.C3
  Inner3 w0.127: v1(37.67,22.63) 34.98,22.63 30.6,27.01 v1(30.6,27.14)
  Bottom Layer w0.127: U7.J7 30.33,26.87 v1(30.6,27.14)
DDR-CK#: length 10
  Top Layer w0.127: U4.C2 37.85,21.94 v1(37.67,22.13)
  Inner3 w0.127: v1(30.61,26.5) 30.61,26.19 34.49,22.31 37.48,22.31 v1(37.67,22.13)
  Bottom Layer w0.127: v1(30.61,26.5) 30.17,26.07 U7.K7
DML: length 21.3
  Top Layer w0.127: U4.G1 40.49,20.09 v1(40.35,19.94)
  Bottom Layer w0.127: U7.E7 30.73,30.07 31.12,29.68 31.12,21.51 33.52,19.11 39.26,19.11 39.28,19.14 39.55,19.14 v1(40.35,19.94)
DMU: length 15
  Top Layer w0.127: v1(42.88,22.33) 43.09,22.54 U4.L3
  Inner3 w0.127: v1(33.7,31.19) 36.33,31.19 41.84,25.69 41.84,24.62 41.91,24.55 41.91,24.53 42.44,24 42.44,22.77 v1(42.88,22.33)
  Bottom Layer w0.127: v1(33.7,31.19) 33.68,31.19 U7.D3
DQ0: length 13.6
  Top Layer w0.127: v1(41.43,22.93) 41.74,23.24 U4.J4
  Inner3 w0.127: v1(33.7,30.48) 36.66,30.48 36.66,30.48 41.28,25.87 41.28,23.08 v1(41.43,22.93)
  Bottom Layer w0.127: v1(33.7,30.48) 33.7,30.42 U7.E3
DQ1: length 13.6
  Top Layer w0.127: v1(40.81,24.19) 40.51,23.89 U4.G5
  Inner4 w0.127: v1(30.61,28.92) 31.03,28.5 37.12,28.5 40.81,24.82 v1(40.81,24.19)
  Bottom Layer w0.127: v1(30.61,28.92) 30.26,29.27 U7.F7
DQ2: length 20
  Top Layer w0.127: U4.H4 41.14,23.34 v1(40.93,23.55)
  Inner4 w0.127: v1(40.93,23.55) 41.02,23.46 41.02,22.69 41.4,22.31 41.4,21.68 42.04,21.04 43.43,21.04 44.45,22.06 44.45,22.41 42.99,23.87 42.42,23.87 36.8,29.49 35.05,29.49 34.87,29.67 v1(34.53,29.67)
  Bottom Layer w0.127: U7.F2 34.15,29.29 v1(34.53,29.67)
DQ3: length 18.6
  Top Layer w0.127: v1(42.81,21.56) 42.82,21.56 U4.L1
  Inner4 w0.127: v1(29.71,29.53) 29.96,29.53 30.46,30.03 30.75,30.03 31.14,29.65 31.15,29.65 31.54,29.26 36.71,29.26 42.42,23.55 42.42,21.95 v1(42.81,21.56)
  Bottom Layer w0.127: U7.F8 29.44,29.27 v1(29.71,29.53)
DQ4: length 15.9
  Top Layer w0.127: v1(33.4,20.66) 33.4,20.41 33.78,20.03 38.35,20.03 38.86,20.54 38.86,21.11 38.91,21.16 38.91,21.41 39.19,21.69 U4.E2
  Bottom Layer w0.127: U7.H3 31.88,26.19 31.88,22.19 v1(33.4,20.66)
DQ5: length 13.2
  Top Layer w0.127: U4.F1 39.84,21.35 v1(39.63,21.56)
  Inner4 w0.127: v1(39.63,21.56) 39.63,21.65 33.6,27.68 30.27,27.68 30.25,27.69 v1(29.65,27.69)
  Bottom Layer w0.127: U7.H8 29.37,27.69 v1(29.65,27.69)
DQ6: length 11.1
  Top Layer w0.127: U4.E3 39.37,22.59 v1(39.42,22.65)
  Bottom Layer w0.127: v1(39.42,22.65) 39.97,23.19 39.97,23.42 40.39,23.84 40.39,25.27 38.51,27.14 37.08,27.14 35.39,28.83 34.58,28.83 34.22,28.47 U7.G2
DQ7: length 15
  Top Layer w0.127: v1(42.08,21.99) 42.13,21.94 U4.K2
  Inner3 w0.127: v1(42.08,21.99) 41.61,21.99 40.63,22.97 40.16,22.97 40.03,23.1 38.18,23.1 33.26,28.02 v1(30.41,28.02)
  Bottom Layer w0.127: U7.H7 30.41,27.93 v1(30.41,28.02)
DQ8: length 14.6
  Top Layer w0.127: v1(40.37,23.34) 40.27,23.24 U4.F4
  Inner2 w0.127: v1(30.86,30.44) 30.89,30.44 35.2,26.13 37.47,26.13 38.36,25.23 39.62,25.23 40.37,24.49 v1(40.37,23.34)
  Bottom Layer w0.127: v1(30.86,30.44) 30.58,30.44 U7.D7
DQ9: length 16.6
  Top Layer w0.127: v1(40.27,21.67) 40.49,21.89 U4.G2
  Inner1 w0.127: v1(33.63,31.89) 34.14,31.37 35.14,31.37 40.27,26.24 40.27,26.06 42.3,24.03 42.3,22.7 41.27,21.67 v1(40.27,21.67)
  Bottom Layer w0.127: v1(33.63,31.89) 33.57,31.89 U7.C3
DQ10: length 19.5
  Top Layer w0.127: U4.L4 43.43,23.58 43.43,24.22 42.96,24.7 v1(42.24,24.7)
  Inner1 w0.127: v1(42.24,24.7) 42.24,25.79 35.73,32.3 30.02,32.3 v1(29.7,31.98)
  Bottom Layer w0.127: U7.C8 29.38,31.67 v1(29.7,31.98)
DQ11: length 15.5
  Top Layer w0.127: U4.D3 38.54,23.16 38.92,23.54 v1(38.92,23.57)
  Inner3 w0.127: v1(34.45,31.71) 34.29,31.55 33.55,31.55 33.36,31.36 33.36,30.29 33.55,30.1 33.82,30.1 33.95,30.22 36.54,30.22 39.84,26.92 39.84,24.49 v1(38.92,23.57)
  Bottom Layer w0.127: U7.C2 34.4,31.67 v1(34.45,31.71)
DQ12: length 21
  Top Layer w0.127: v1(43.48,22.39) 43.48,22.33 U4.L2
  Bottom Layer w0.127: v1(43.48,22.39) 43.48,23.93 35.56,31.86 35.56,33.62 35.18,34 30.86,34 v1(30.61,33.74) 30.61,33.72 U7.A7
DQ13: length 17.8
  Top Layer w0.127: v1(40.16,22.22) 40.16,22.27 U4.F3
  Inner2 w0.127: v1(34.56,32.85) 43.18,24.24 43.18,23.2 42.47,22.5 41.07,22.5 40.95,22.61 40.56,22.61 v1(40.16,22.22)
  Bottom Layer w0.127: U7.A2 v1(34.56,32.85)
DQ14: length 23.2
  Top Layer w0.127: v1(44.07,22.31) 44.07,22.27 U4.M2
  Bottom Layer w0.127: U7.B8 29.72,32.83 v1(29.72,32.85) 29.72,33.56 30.41,34.25 35.31,34.25 35.81,33.74 35.81,31.93 44.07,23.67 v1(44.07,22.31)
DQ15: length 15.2
  Top Layer w0.127: v1(42.66,24.28) 42.66,24.11 U4.K5
  Bottom Layer w0.127: v1(42.66,24.28) 42.18,24.28 41.71,24.74 41.71,25.38 35.33,31.76 35.33,33.4 35.08,33.65 v1(33.73,33.65) U7.A3
DQSL: length 12.3
  Top Layer w0.127: U4.J3 41.79,22.67 v1(41.96,22.84)
  Inner1 w0.127: v1(41.96,22.84) 41.96,24.05 38.97,27.04 36.86,27.04 35.05,28.85 v1(33.75,28.85)
  Bottom Layer w0.127: U7.F3 33.75,28.86 v1(33.75,28.85)
DQSL#: length 12
  Top Layer w0.127: v1(42.79,23.53) 42.5,23.24 U4.K4
  Inner2 w0.127: v1(42.79,23.53) 42.79,23.6 39.24,27.14 34.69,27.14 v1(33.77,28.06)
  Bottom Layer w0.127: v1(33.77,28.06) 33.75,28.06 U7.G3
DQSU: length 22.7
  Top Layer w0.127: U4.H2 41.14,21.35 v1(41.09,21.3)
  Bottom Layer w0.127: v1(41.09,21.3) 41.09,21.27 39.16,19.34 33.61,19.34 31.37,21.58 31.37,30.43 30.15,31.65 U7.C7
DQSU#: length 23.5
  Top Layer w0.127: U4.H3 40.82,22.27 v1(40.82,22.22)
  Bottom Layer w0.127: 40.74,21.24 40.74,22.14 v1(40.82,22.22) ; U7.B7 31.62,30.99 31.62,21.68 33.66,19.65 39.14,19.65 40.72,21.23
GPIO1_D0: length 41.4
  Top Layer w0.127: H1.3 21.59,42.13 23.24,40.47 29.12,40.47 34.46,35.14 49.4,35.14 51.69,32.85 R39.2
GPIO1_D1: length 41.8
  Top Layer w0.127: R40.1 52.56,32.49 49.55,35.5 34.63,35.5 25.08,45.05 H1.5
ODT: length 4.3
  Top Layer w0.127: 37.89,23.9 37.89,23.95 v1(37.62,24.23)
  Inner3 w0.127: v1(37.62,24.23) 37.62,24.96 36.78,25.79 v1(36.32,25.79)
  Bottom Layer w0.127: U7.K1 35.24,26.07 35.56,25.74 36.28,25.74 v1(36.32,25.79)
P3: length 71.3
  Top Layer w0.127: U4.P3 45.04,22.43 v1(45.41,22.06) ; R34.2 74.91,25.2 SW3.1
  Inner1 w0.127: v1(45.41,22.06) 45.75,22.4 45.75,27.5 43.69,29.55 43.69,35.08 34.85,43.92 33.82,43.92 33.16,44.58 33.16,45.61 32.58,46.19 27.81,46.19 H1.7
  Inner4 w0.127: v1(45.41,22.06) 46.25,22.06 46.56,21.76 50.37,21.76 51.31,22.69 73.91,22.69 74.99,23.77 74.99,25.3 v1(74.8,25.49)
PP1: length 27.3
  Top Layer w0.127: v1(48.55,23.09) 48.45,23.09 U4.W4
  Inner2 w0.127: v1(48.55,23.09) 48.55,23.67 48.26,23.95 48.26,24.28 48.29,24.31 48.29,27.11 44.7,30.7 44.7,43.49 45.58,44.36 45.58,46.46 H1.22
PP2: length 15
  Top Layer w0.127: v1(49.15,31.33) 49.15,31.25 U4.Y16
  Inner1 w0.127: H1.23 48.69,43.34 48.69,31.79 v1(49.15,31.33)
PP3: length 18.2
  Top Layer w0.127: 48.51,31.33 48.29,31.11 U4.W16
  Inner1 w0.127: H1.24 46.99,46.68 45.84,45.52 45.84,44.57 48.29,42.12 48.29,31.56 v1(48.51,31.33)
PP4: length 21.5
  Top Layer w0.127: v1(46.61,30.7) 46.34,30.43 U4.T15
  Inner2 w0.127: v1(46.61,30.7) 46.18,30.27 45.8,30.27 45.55,30.52 45.55,31.51 50.8,36.76 50.8,46.32 H1.26
PP5: length 19.6
  Top Layer w0.127: U4.R16 45.69,31.05 v1(45.97,31.33)
  Inner1 w0.127: v1(45.97,31.33) 46.64,31.33 47.07,30.9 49.33,30.9 49.58,31.15 49.58,31.68 49.1,32.15 49.1,34.46 52.07,37.43 H1.27
PP6: length 28.3
  Top Layer w0.127: U4.V14 47.64,29.8 v1(47.89,30.05)
  Inner1 w0.127: v1(47.89,30.05) 47.94,30.09 49.66,30.09 50.48,30.9 50.48,34.65 58.3,42.47 58.3,45.52 57.51,46.32 53.34,46.32 H1.28
PP7: length 22.5
  Top Layer w0.127: U4.J15 41.83,30.39 v1(42.04,30.19)
  Bottom Layer w0.127: H1.29 54.61,42.76 44.25,32.4 42.56,32.4 42.34,32.18 42.34,31.86 42.56,31.64 42.74,31.64 43.11,31.26 43.11,30.97 43.12,30.96 43.12,30.65 42.9,30.43 42.28,30.43 v1(42.04,30.19)
PP8: length 25.6
  Top Layer w0.127: v1(47.24,31.33) 46.99,31.08 U4.U16
  Inner1 w0.127: v1(47.24,31.33) 46.84,31.74 46.17,31.74 46.15,31.76 45.8,31.76 45.55,31.51 45.55,30.52 45.8,30.27 46.79,30.27 47.01,30.5 49.5,30.5 49.98,30.98 49.98,31.97 49.51,32.45 49.51,34.25 57.15,41.9 H1.31
PP9: length 23.2
  Top Layer w0.127: U4.K16 42.68,30.8 v1(42.75,30.8)
  Inner4 w0.127: H1.32 57.15,46.64 56.02,45.51 56.02,44.08 v1(42.75,30.8)
PP10: length 20.5
  Top Layer w0.127: v1(45.97,30.7) 45.97,30.67 U4.R15
  Inner2 w0.127: v1(45.97,30.7) 59.69,44.41 H1.33
PP11: length 30.4
  Top Layer w0.127: U4.F17 39.9,31.69 v1(40.13,31.46)
  Bottom Layer w0.127: H1.35 60.93,46.35 53.98,46.35 53.34,45.71 53.34,44.71 42.28,33.65 41.28,33.65 40.39,32.76 40.39,31.72 v1(40.13,31.46)
PP12: length 36.8
  Top Layer w0.127: U4.J16 41.82,31.04 v1(42.04,30.82)
  Bottom Layer w0.127: H1.36 61.09,48.73 54.99,48.73 54.97,48.71 51.6,48.71 50.94,48.05 50.94,44.68 39.62,33.36 39.62,31.2 40.41,30.42 41.57,30.42 41.97,30.82 v1(42.04,30.82)
PP13: length 32
  Top Layer w0.127: U4.G16 40.55,31.04 v1(40.77,30.82)
  Inner3 w0.127: H1.37 63.5,46.32 56.26,46.32 55.71,45.77 55.71,44.59 43.57,32.44 42.41,32.44 42.19,32.22 42.17,32.22 v1(40.77,30.82)
PP14: length 34.3
  Top Layer w0.127: 39.84,32.99 39.89,32.99 v1(40.13,33.24)
  Inner4 w0.127: H1.38 63.64,48.71 51.6,48.71 50.94,48.05 50.94,44.05 v1(40.13,33.24)
PP15: length 36.4
  Top Layer w0.127: v1(41.4,30.82) 41.18,31.04 U4.H16
  Inner3 w0.127: H1.40 67.31,46.64 66.18,45.51 66.18,44.43 65.53,43.78 55.37,43.78 42.91,31.32 42.91,31.21 43.15,30.97 43.15,30.64 42.3,29.78 41.87,29.78 41.63,30.02 41.63,30.66 41.47,30.82 v1(41.4,30.82)
RAS#: length 7.8
  Top Layer w0.127: U4.D5 38.54,23.66 v1(38.32,23.44)
  Inner1 w0.127: v1(38.32,23.44) 37.92,23.84 35.64,23.84 v1(32.93,26.54)
  Bottom Layer w0.127: v1(32.93,26.54) 33.03,26.54 U7.J3
RESET#: length 7.7
  Top Layer w0.127: v1(35.87,20.49) 38.04,20.49 38.61,21.06 38.61,21.43 38.86,21.69 38.86,22.91 U4.E4
  Bottom Layer w0.127: U7.T2 34.15,20.88 34.54,20.48 35.86,20.48 v1(35.87,20.49)
RXD: length 47.7
  Top Layer w0.127: v1(42.72,32.02) 42.67,31.98 40.46,31.98 40.16,32.28 40.16,32.43 39.96,32.63 37.13,32.63 36.96,32.46 36.96,31.33 36.58,30.95 U4.A15 ; v1(49.91,20.54) 54.23,20.54 v1(54.36,20.41)
  Bottom Layer w0.127: U11.3 49.45,20.54 v1(49.91,20.54) ; v1(54.36,20.41) 52.32,22.44 52.32,27.01 51.82,27.52 47.21,27.52 v1(42.72,32.02)
SD3: length 23.2
  Top Layer w0.127: v1(37.72,30.82) 37.89,31 U4.C16
  Inner2 w0.127: v1(50.04,22.65) 53.64,22.65 v1(55.88,20.41)
  Inner4 w0.127: v1(37.72,30.82) 37.72,30.06 43.87,23.91 45.27,23.91 46.53,22.65 v1(50.04,22.65)
SD4: length 31.9
  Top Layer w0.127: v1(37.47,31.33) 37.47,31.26 U4.B16
  Inner3 w0.127: v1(37.47,31.33) 38.11,31.33 38.86,30.58 38.86,29.58 39.65,28.79 39.98,28.79 46.4,22.37 46.4,22.05 46.6,21.85 46.88,21.85 47.08,22.05 47.35,22.05 47.75,21.65 53.75,21.65 60.33,15.07 v1(60.33,14.06)
SD5: length 29.5
  Top Layer w0.127: v1(37.47,31.97) 37.47,31.91 U4.B17
  Inner1 w0.127: v1(58.8,18.76) 48.07,18.76 47.46,19.37 46.11,19.37 44.64,20.84 44.64,22.5 44.2,22.95 44.2,25.23 v1(37.47,31.97)
SD6: length 28.7
  Top Layer w0.127: U4.A17 36.28,32.01 v1(36.28,32.62)
  Inner3 w0.127: v1(36.28,32.62) 37.94,32.62 39.57,30.99 39.59,30.99 39.79,30.79 39.79,29.93 47.85,21.88 57.21,21.88 v1(58.42,20.66)
SD7: length 26.9
  Top Layer w0.127: v1(45.25,22.99) 45.25,23.04 U4.P4
  Inner1 w0.127: v1(64.77,13.93) 65.02,14.19 65.02,16.09 61.47,19.65 46.23,19.65 44.92,20.95 44.92,22.48 45.25,22.81 v1(45.25,22.99)
SDIO_CLK: length 48.7
  Top Layer w0.127: U12.31 v1(22.93,7.75) ; U4.J18 42.04,32.59 v1(42.04,32.6)
  Inner1 w0.127: v1(22.93,7.75) 22.93,9.67 22.45,10.15 22.45,33.39 24.74,35.68 39.09,35.68 42.04,32.73 v1(42.04,32.6)
SDIO_CMD: length 56.7
  Top Layer w0.127: U4.H18 v1(41.4,32.6)
  Inner1 w0.127: v1(41.4,32.6) 41.4,32.93 38.96,35.37 24.87,35.37 22.76,33.26 22.76,11.19 24.38,9.56 24.38,8.72 27.81,5.3 31.62,5.3 v1(32.77,6.44)
SDIO_D0: length 53.6
  Top Layer w0.127: 41.79,32.99 41.85,32.99 v1(42.13,33.27)
  Inner1 w0.127: v1(42.13,33.27) 39.42,35.98 24.61,35.98 21.71,33.08 21.71,3.65 22.22,3.14 v1(22.48,3.14)
SDIO_D1: length 44.7
  Top Layer w0.127: v1(42.04,31.46) 41.8,31.69 U4.J17
  Inner1 w0.127: v1(19.56,15.33) 19.56,31.36 24.49,36.29 39.54,36.29 42.18,33.65 42.28,33.65 42.5,33.43 42.5,32.53 42.04,32.07 v1(42.04,31.46)
SDIO_D2: length 52.9
  Top Layer w0.127: v1(40.77,32.6) 40.51,32.34 U4.G18
  Inner1 w0.127: v1(30.99,7.96) 30.99,7.71 29.59,6.31 28.07,6.31 23.06,11.32 23.06,33.13 24.99,35.06 38.84,35.06 40.77,33.13 v1(40.77,32.6)
SDIO_D3: length 50
  Top Layer w0.127: U4.G17 40.53,31.69 v1(40.77,31.46)
  Inner1 w0.127: v1(29.34,6.82) 27.99,6.82 23.37,11.44 23.37,33.01 25.12,34.76 38.61,34.76 39.24,34.12 39.24,33.59 40.77,32.07 v1(40.77,31.46)
T1: length 28.7
  Top Layer w0.127: v1(46.1,21.55) 46.34,21.31 U4.T1
  Inner1 w0.127: 34.29,45.05 44.05,35.29 44.05,29.9 46.1,27.84 v1(46.1,21.55)
TXD: length 43.4
  Top Layer w0.127: U4.B15 37.57,30.07 v1(40.13,30.07) ; v1(39.12,11.76) 45.97,11.76 v1(50.55,16.34)
  Bottom Layer w0.127: v1(39.12,11.76) 37.47,10.11 U11.2 ; v1(40.13,30.07) 41.02,30.07 43.82,27.27 51.75,27.27 52.03,26.98 52.03,17.82 v1(50.55,16.34)
U2: length 32.9
  Top Layer w0.127: v1(46.74,22.19) 46.75,22.19 U4.U2
  Inner2 w0.127: H1.12 32.97,46.37 34.56,46.37 35.42,45.51 35.42,45.43 35.7,45.14 35.7,44.58 43.21,37.08 43.21,30.54 46.1,27.65 46.1,22.82 v1(46.74,22.19)
U4: length 28.6
  Top Layer w0.127: v1(46.72,23.57) 46.72,23.52 U4.U4
  Inner2 w0.127: v1(46.72,23.57) 46.72,27.54 43.56,30.7 43.56,37.68 38.1,43.14 38.1,46.44 39.24,47.59 H1.18
U14: length 45.6
  Top Layer w0.127: U4.U14 46.99,29.8 v1(47.25,30.05) ; H1.10 30.34,48.71 42.56,48.71 43.18,48.09 43.18,46.32 H1.21
  Inner1 w0.127: v1(47.25,30.05) 47.15,30.05 46.96,29.86 45.63,29.86 45.14,30.35 45.14,31.68 47.47,34.01 47.47,38.7 44.23,41.93 42.29,41.93 40.76,43.47 40.76,45.52 41.43,46.2 43.3,46.2 H1.21
WE#: length 6.6
  Top Layer w0.127: U4.E8 39.01,26.03 v1(39.01,26.08)
  Bottom Layer w0.127: v1(39.01,26.08) 38.61,26.08 38.43,25.9 38.42,25.9 37.79,25.27 35.66,25.27 35.29,25.63 33.71,25.63 U7.L3
WRX: length 53.4
  Top Layer w0.127: U12.27 21.33,5.56 v1(21.34,5.55) ; v1(51.69,26.76) 51.31,27.14 49.91,27.14 49.91,27.14 U4.V10
  Bottom Layer w0.127: v1(51.69,26.76) 51.69,20.28 47.12,15.71 47.12,7.84 44.83,5.55 v1(21.34,5.55)
WTX: length 52.7
  Top Layer w0.127: v1(20.57,5.93) 20.53,5.98 U12.25 ; v1(50.93,24.22) 50.93,25.31 49.43,26.81 46.67,26.81 U4.T10
  Bottom Layer w0.127: v1(50.93,24.22) 50.93,20.41 46.61,16.09 46.61,7.84 44.7,5.93 v1(20.57,5.93)
XI: length 16.3
  Top Layer w0.127: X3.1 23.05,19.54 C41.1 23.05,15.9 21.72,14.57 18.67,14.57 18.03,13.93 18.03,11.77 18.26,11.55 U12.15
XIN: length 26.5
  Top Layer w0.127: C23.1 23.37,26.24 22.72,26.89 22.72,28.01 X1.1 21.17,29.55 21.17,31.11 24.51,34.45 38.48,34.45 38.87,34.07 38.87,33.37 v1(38.86,33.36) 39.19,33.03 39.19,32.99
XO: length 21.8
  Top Layer w0.127: U12.16 18.23,11.15 17.73,11.65 17.73,14.61 19.73,16.61 19.73,24.47 X3.3 16.86,25.58 C40.2
XOUT: length 27
  Top Layer w0.127: U4.E20 39.19,34.17 38.61,34.76 24.38,34.76 20.19,30.57 20.19,28.96 X1.3 18.82,27.58 C21.2
Y5: length 26.2
  Top Layer w0.127: v1(48.67,24.12) 48.72,24.12 U4.Y5
  Inner1 w0.127: H1.15 44.76,37.12 44.76,30.19 48.67,26.28 v1(48.67,24.12)
$1N10142: length 5.1
  Bottom Layer w0.127: 52.32,16.34 54.48,16.34 55.92,14.91 TF1.1
$1N10185: length 6.3
  Bottom Layer w0.127: TF1.2 57.02,14.46 54.23,17.24 54.23,19.15
$1N10228: length 5.8
  Bottom Layer w0.127: 58.12,14.03 58.12,15.77 55.88,18 R4.2
$1N10271: length 5.7
  Bottom Layer w0.127: R5.2 60.45,17.24 62.52,15.18 TF1.7
$1N10314: length 8.4
  Bottom Layer w0.127: R6.2 60.31,20.66 63.62,17.36 63.62,14.03
$1N14120: length 3.6
  Top Layer w0.127: U8.4 60.77,7.71 C29.1
$1N27095: length 3.2
  Bottom Layer w0.127: U7.L8 28.91,25.7 27.61,25.7 R13.2
$1N27705: length 7.5
  Bottom Layer w0.127: R15.2 24.78,25.86 R14.2 26.53,24.35 27.91,24.35 28.42,24.85 29.08,24.85 29.35,24.59 U7.M8
$1N29645: length 30.2
  Top Layer w0.127: 37.24,29.09 36.46,29.88 v1(36.02,29.88)
  Inner4 w0.127: v1(14.86,16.6) 15.49,16.6 23.62,24.73 23.62,26.76 27.69,30.82 35.08,30.82 v1(36.02,29.88)
$1N29684: length 27.9
  Top Layer w0.127: v1(36.93,28.16) 37.22,28.44 37.24,28.44
  Inner3 w0.127: v1(36.93,28.16) 36.6,28.5 29.65,28.5 29.18,28.03 23.75,28.03 22.35,29.43 22.35,33.36 20.96,34.76 v1(14.86,34.76)
$1N29723: length 41.7
  Top Layer w0.127: v1(36.32,28.92) 36.42,28.92 36.59,29.09
  Inner3 w0.127: v1(36.32,28.92) 35.98,29.26 31.57,29.26 25.72,35.1 14.72,35.1 14.52,34.9 14.52,18.34 v1(14.73,18.12)
$1N29762: length 25.1
  Top Layer w0.127: v1(35.78,28.92) 36.26,28.44 U4.A12
  Inner2 w0.127: v1(35.78,28.92) 34.22,28.92 33.91,29.23 32.61,29.23 31.01,30.82 24.89,30.82 20.96,34.76 16.38,34.76 v1(14.8,36.35)
$1N33959: length 11.1
  Top Layer w0.127: U12.32 23.33,5.97 24.5,4.8 32.77,4.8
$1N33998: length 2.6
  Top Layer w0.127: U12.30 22.53,4.58 R22.1
$1N34037: length 8.5
  Top Layer w0.127: U12.29 22.13,7.53 21.81,7.85 20.55,7.85 20.33,8.07 20.33,12.53 19.56,13.3 R23.1
$1N34076: length 6.9
  Top Layer w0.127: U12.33 23.75,7.13 23.75,6.18 24.5,5.43 R24.1
$1N36646: length 8.2
  Top Layer w0.127: R25.1 31.06,6.45 ; 31.06,6.45 31.19,6.58 ; 31.06,6.45 30.81,6.21 24.36,6.21 24.13,6.44 U12.34
$1N40142: length 3.9
  Top Layer w0.127: R26.2 26.23,13.35 25.53,14.06 23.88,14.06 23.73,13.92 23.73,13.15 U12.4
$1N40260: length 21.5
  Top Layer w0.127: v1(27.05,12.28) 26.98,12.35 U12.48 ; U14.1 9.05,7.45 11.18,7.45 v1(16,12.28)
  Bottom Layer w0.127: v1(16,12.28) 16.09,12.37 26.96,12.37 v1(27.05,12.28)
$1N42864: length 3.8
  Top Layer w0.127: 29.46,10.52 29.28,10.35 U12.43
$1N43059: length 38
  Top Layer w0.127: U12.44 26.28,10.75 26.8,11.26 52.97,11.26 R28.1
$1N43166: length 37.5
  Top Layer w0.127: R29.1 60.21,16.85 59.83,16.85 52.92,9.95 U12.42
$1N43323: length 2.1
  Top Layer w0.127: U12.40 27.07,9.15 C44.2
$1N47046: length 2.2
  Top Layer w0.127: LED2.2 62.09,18.63 R28.2
$1N47049: length 2.5
  Top Layer w0.127: R29.2 64.14,16.98 LED1.1
$1N48310: length 3.3
  Top Layer w0.127: C24.2 74.74,33.41 R1.2 SW2.1
$1N48313: length 43.4
  Top Layer w0.127: U4.B20 36.96,33.36 v1(36.96,33.36) ; v1(38.23,39.21) 74.54,39.21 SW2.2
  Inner4 w0.127: v1(38.23,39.21) 38.23,34.63 v1(36.96,33.36)
$1N51444: length 7.4
  Top Layer w0.127: U4.N3 44.7,22.9 v1(44.7,22.95)
  Inner2 w0.127: v1(44.7,22.95) 44.7,19.77 v1(42.04,17.11)
$1N51483: length 8.6
  Top Layer w0.127: U4.N4 44.7,23.55 v1(44.7,23.57)
  Bottom Layer w0.127: 41.77,19.01 44.31,21.55 45.47,21.55 46.1,22.19 46.1,23.08 45.61,23.57 v1(44.7,23.57)
$1N51672: length 2.1
  Top Layer w0.127: LED3.2 62.03,20.41 R32.2
$1N52332: length 7.4
  Top Layer w0.127: U4.C15 38.2,30.7 v1(38.23,30.7)
  Bottom Layer w0.127: v1(38.23,30.7) 38.23,33.19 37.15,34.27 R33.1
$1N59229: length 5.9
  Top Layer w0.127: LED4.1 64.26,22.2 R35.2
$1N59832: length 7
  Top Layer w0.127: 31.6,32.06 R37.2 31.68,30.19 33.39,30.19 33.53,30.05 33.53,29.78 v1(35.25,28.06)
  Bottom Layer w0.127: U7.H1 35.25,27.97 v1(35.25,28.06)
$1N60456: length 2.7
  Top Layer w0.127: U6.3 72.83,14.5 72.59,14.26

## Copper pours and planes (outline as drawn; the poured copper is in the pictures)
GND on Top Layer: -4.44,56.86 81.28,56.86 83.19,54.95 83.19,-11.21 82.04,-12.36 0.51,-12.36 -6.35,-5.5 -4.44,-3.59
GND on Bottom Layer: -6.73,55.84 83.19,55.84 83.19,-2.83 83.31,-2.96 -6.22,-2.96 -6.35,-3.09 -6.73,-2.71

## Text on the board
Top Silkscreen Layer: github.com/thagreatjoel
